# Altium schematic sheet PMIC CTRL.SchDoc
size A4; SheetNumber: 21; SheetTotal: 21
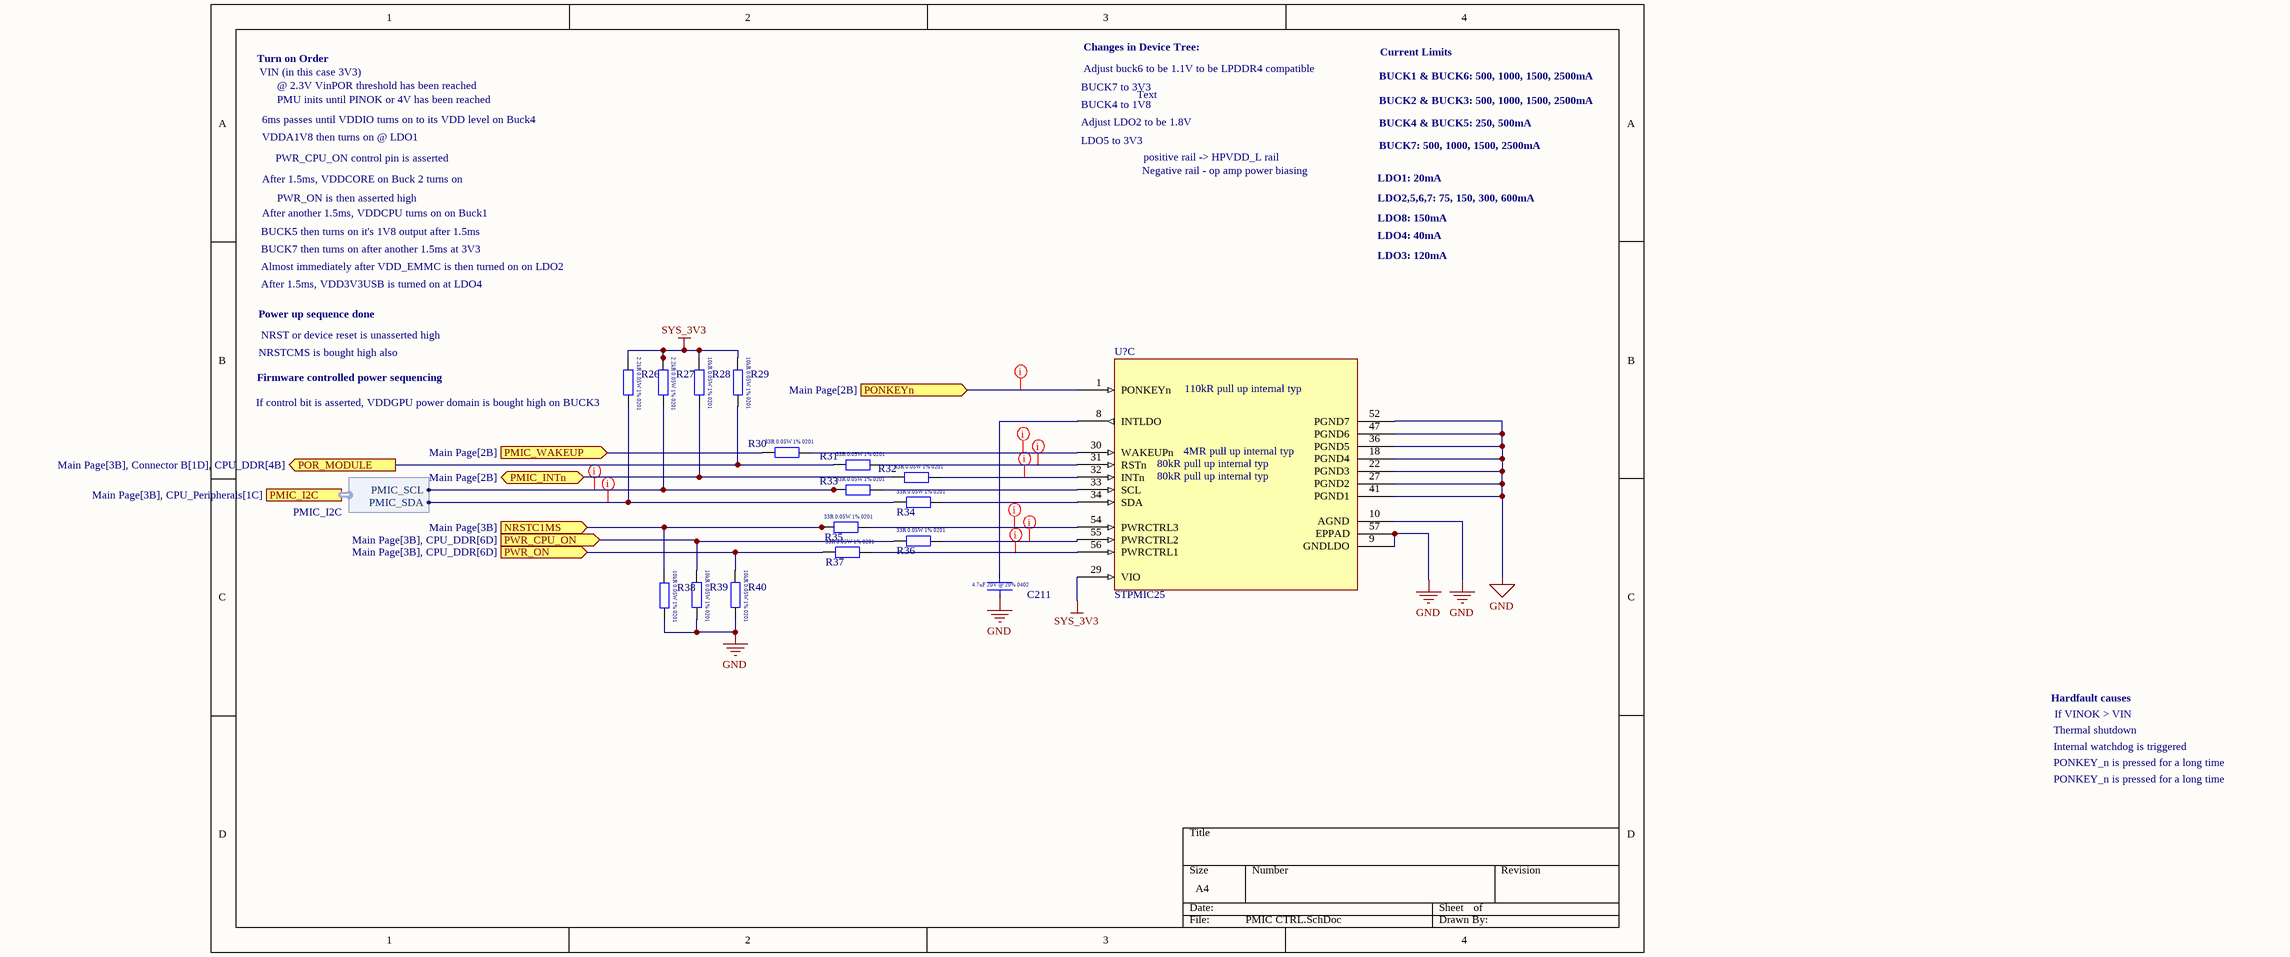
[diagram p0: PMIC CTRL.SchDoc]

## Parts
C211  4.7uF  [CAPC1005X06L]  (value not drawn)
R26  RC0201FR-072K2L  [RESC0603X03L]  (value not drawn)
R27  RC0201FR-072K2L  [RESC0603X03L]  (value not drawn)
R28  ERJ-1GNF1002C  [RESC0603X03L]  (value not drawn)
R29  ERJ-1GNF1002C  [RESC0603X03L]  (value not drawn)
R30  ERJ-1GNF33R0C  [RESC0603X03L]  (value not drawn)
R31  ERJ-1GNF33R0C  [RESC0603X03L]  (value not drawn)
R32  ERJ-1GNF33R0C  [RESC0603X03L]  (value not drawn)
R33  ERJ-1GNF33R0C  [RESC0603X03L]  (value not drawn)
R34  ERJ-1GNF33R0C  [RESC0603X03L]  (value not drawn)
R35  ERJ-1GNF33R0C  [RESC0603X03L]  (value not drawn)
R36  ERJ-1GNF33R0C  [RESC0603X03L]  (value not drawn)
R37  ERJ-1GNF33R0C  [RESC0603X03L]  (value not drawn)
R38  ERJ-1GNF1002C  [RESC0603X03L]  (value not drawn)
R39  ERJ-1GNF1002C  [RESC0603X03L]  (value not drawn)
R40  ERJ-1GNF1002C  [RESC0603X03L]  (value not drawn)
U?  STPMIC25  [QFN127P600-8N]  (part C of 3)

## Ports
NRSTC1MS (in, see Main Page[3B]), PMIC_I2C (harness PMIC_I2C, see Main Page[3B], CPU_Peripherals[1C]), PMIC_INTn (bidir, see Main Page[2B]), PMIC_WAKEUP (in, see Main Page[2B]), PONKEYn (in, see Main Page[2B]), POR_MODULE (out, see Main Page[3B], Connector B[1D], CPU_DDR[4B]), PWR_CPU_ON (in, see Main Page[3B], CPU_DDR[6D]), PWR_ON (in, see Main Page[3B], CPU_DDR[6D])

## Harnesses
PMIC_I2C: PMIC_SCL, PMIC_SDA

## Nets
GND: C211.1 R38.2 R39.2 R40.2 U?.9(GNDLDO) U?.10(AGND) U?.18(PGND4) U?.22(PGND3) U?.27(PGND2) U?.36(PGND5) U?.41(PGND1) U?.47(PGND6) U?.52(PGND7) U?.57(EPPAD)
SYS_3V3: R26.1 R27.1 R28.1 R29.1 U?.29(VIO)
NRSTC1MS: R35.1 R38.1 ; port NRSTC1MS
PMIC_INTn: R28.2 R32.1 ; port PMIC_INTn
PMIC_WAKEUP: R30.1 ; port PMIC_WAKEUP
PONKEYn: U?.1(PONKEYn) ; port PONKEYn
POR_MODULE: R29.2 R31.1 ; port POR_MODULE
PWR_CPU_ON: R36.1 R39.1 ; port PWR_CPU_ON
PWR_ON: R37.1 R40.1 ; port PWR_ON
NetC211_2: C211.2 U?.8(INTLDO)
NetR26_2: R26.2 R34.1 ; port PMIC_I2C.PMIC_SDA
NetR27_2: R27.2 R33.1 ; port PMIC_I2C.PMIC_SCL
NetR30_2: R30.2 U?.30(WAKEUPn)
NetR31_2: R31.2 U?.31(RSTn)
NetR32_2: R32.2 U?.32(INTn)
NetR33_2: R33.2 U?.33(SCL)
NetR34_2: R34.2 U?.34(SDA)
NetR35_2: R35.2 U?.54(PWRCTRL3)
NetR36_2: R36.2 U?.55(PWRCTRL2)
NetR37_2: R37.2 U?.56(PWRCTRL1)

## Layout directives
net class I2C_PWR: NetR26_2, NetR27_2
net class PMIC_CTRL: (no net found under the mark), NetR30_2, NetR31_2, NetR32_2, NetR36_2, PONKEYn

## Notes on the sheet
- Turn on Order
- VIN (in this case 3V3)
- @ 2.3V VinPOR threshold has been reached
- PMU inits until PINOK or 4V has been reached
- BUCK7 to 3V3
- Changes in Device Tree:
- Adjust buck6 to be 1.1V to be LPDDR4 compatible
- Text
- BUCK1 & BUCK6: 500, 1000, 1500, 2500mA
- BUCK2 & BUCK3: 500, 1000, 1500, 2500mA
- Current Limits
- 6ms passes until VDDIO turns on to its VDD level on Buck4
- VDDA1V8 then turns on @ LDO1
- PWR_CPU_ON control pin is asserted
- Adjust LDO2 to be 1.8V
- BUCK4 to 1V8
- LDO5 to 3V3
- positive rail -> HPVDD_L rail
- BUCK4 & BUCK5: 250, 500mA
- BUCK7: 500, 1000, 1500, 2500mA
- After 1.5ms, VDDCORE on Buck 2 turns on
- After another 1.5ms, VDDCPU turns on on Buck1
- PWR_ON is then asserted high
- Negative rail - op amp power biasing
- LDO1: 20mA
- LDO2,5,6,7: 75, 150, 300, 600mA
- LDO8: 150mA
- BUCK5 then turns on it's 1V8 output after 1.5ms
- BUCK7 then turns on after another 1.5ms at 3V3
- Almost immediately after VDD_EMMC is then turned on on LDO2
- After 1.5ms, VDD3V3USB is turned on at LDO4
- LDO4: 40mA
- LDO3: 120mA
- Power up sequence done
- NRSTCMS is bought high also
- NRST or device reset is unasserted high
- (near R26) If control bit is asserted, VDDGPU power domain is bought high on BUCK3
- Firmware controlled power sequencing
- (near U?) 110kR pull up internal typ
- (near U?) 80kR pull up internal typ
- (near U?) 4MR pull up internal typ
- Hardfault causes
- If VINOK > VIN
- Thermal shutdown
- Internal watchdog is triggered
- PONKEY_n is pressed for a long time
- (in symbol CL05A475MO5NUNC) 4.7uF 20V @ 20% 0402
- (in symbol ERJ-1GNF33R0C) 33R 0.05W 1% 0201
- (in symbol ERJ-1GNF1002C) 10kR 0.05W 1% 0201
- (in symbol RC0201FR-072K2L) 2.2kR 0.05W 1% 0201

## Library data of the parts
C211 = CL05A475MO5NUNC: 4.7 µF ±20% 16V Ceramic Capacitor X5R 0402 (1005 Metric)
R26 R27 = RC0201FR-072K2L: 2.2 kOhms ±1% 0.05W, 1/20W Chip Resistor 0201 (0603 Metric) Moisture Resistant Thick Film
R28 R29 R38-R40 = ERJ-1GNF1002C: 10 kOhms ±1% 0.05W, 1/20W Chip Resistor 0201 (0603 Metric) Thick Film; ComponentLink1Description: New link; ComponentLink1URL: https://www.digikey.com.au/en/products/detail/panasonic-electronic-components/ERJ-1GNF1002C/2036226
R30-R37 = ERJ-1GNF33R0C: 33 Ohms ±1% 0.05W, 1/20W Chip Resistor 0201 (0603 Metric) Thick Film; ComponentLink1Description: New link; ComponentLink1URL: https://www.digikey.com.au/en/products/detail/panasonic-electronic-components/ERJ-1GNF33R0C/2035941